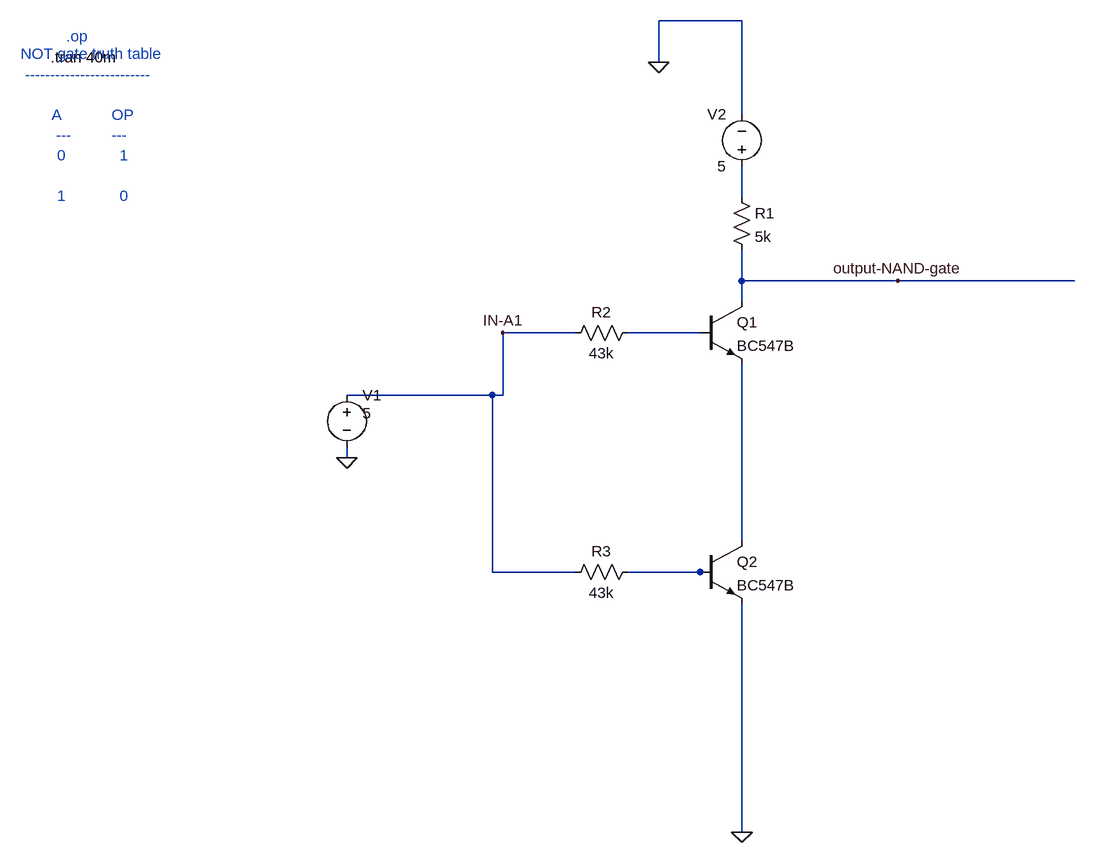
[diagram p0: schematic NOT_gate_using_NAND_gate.asc]
NOT_gate_using_NAND_gate.asc, the LTspice schematic file:
Version 4.1
SHEET 1 2536 1052
WIRE 352 -368 224 -368
WIRE 224 -304 224 -368
WIRE 352 -224 352 -368
WIRE 352 -96 352 -144
WIRE 352 32 352 -16
WIRE 592 32 352 32
WIRE 864 32 592 32
WIRE 352 64 352 32
WIRE 96 112 -16 112
WIRE 288 112 176 112
WIRE -32 208 -256 208
WIRE -16 208 -16 112
WIRE -16 208 -32 208
WIRE -256 304 -256 288
WIRE 352 432 352 160
WIRE -32 480 -32 208
WIRE 96 480 -32 480
WIRE 288 480 176 480
WIRE 304 480 288 480
WIRE 352 880 352 528
FLAG -16 112 IN-A1
FLAG -256 304 0
FLAG 224 -304 0
FLAG 592 32 output-NAND-gate
FLAG 352 880 0
SYMBOL voltage -256 192 R0
WINDOW 3 24 44 Left 2
WINDOW 123 0 0 Left 0
WINDOW 39 0 0 Left 0
SYMATTR Value 5
SYMATTR InstName V1
SYMBOL npn 288 64 R0
SYMATTR InstName Q1
SYMATTR Value BC547B
SYMBOL voltage 352 -128 R180
WINDOW 0 24 96 Left 2
WINDOW 3 24 16 Left 2
WINDOW 123 0 0 Left 0
WINDOW 39 0 0 Left 0
SYMATTR InstName V2
SYMATTR Value 5
SYMBOL res 336 -112 R0
SYMATTR InstName R1
SYMATTR Value 5k
SYMBOL res 192 96 R90
WINDOW 0 0 56 VBottom 2
WINDOW 3 32 56 VTop 2
SYMATTR InstName R2
SYMATTR Value 43k
SYMBOL npn 288 432 R0
SYMATTR InstName Q2
SYMATTR Value BC547B
SYMBOL res 192 464 R90
WINDOW 0 0 56 VBottom 2
WINDOW 3 32 56 VTop 2
SYMATTR InstName R3
SYMATTR Value 43k
TEXT -712 -312 Left 2 !.tran 40m
TEXT -688 -344 Left 2 ;.op
TEXT -648 -208 Center 2 ;NOT gate truth table\n-------------------------\n \nA           OP\n---         ---\n0            1\n \n1            0

The netlist it stands for:
* NOT_gate_using_NAND_gate.asc
V1 IN-A1 0 5
Q1 output-NAND-gate N002 N003 0 BC547B
V2 N001 0 5
R1 N001 output-NAND-gate 5k
R2 N002 IN-A1 43k
Q2 N003 N004 0 0 BC547B
R3 N004 IN-A1 43k
.model NPN NPN
.model PNP PNP
.lib standard.bjt
.tran 40m
* .op
* NOT gate truth table
* -------------------------
* A           OP
* ---         ---
* 0            1
* 1            0
.backanno
.end